# Altium schematic sheet UI_Interface.SchDoc
size A4; SheetNumber: 5; SheetTotal: 6
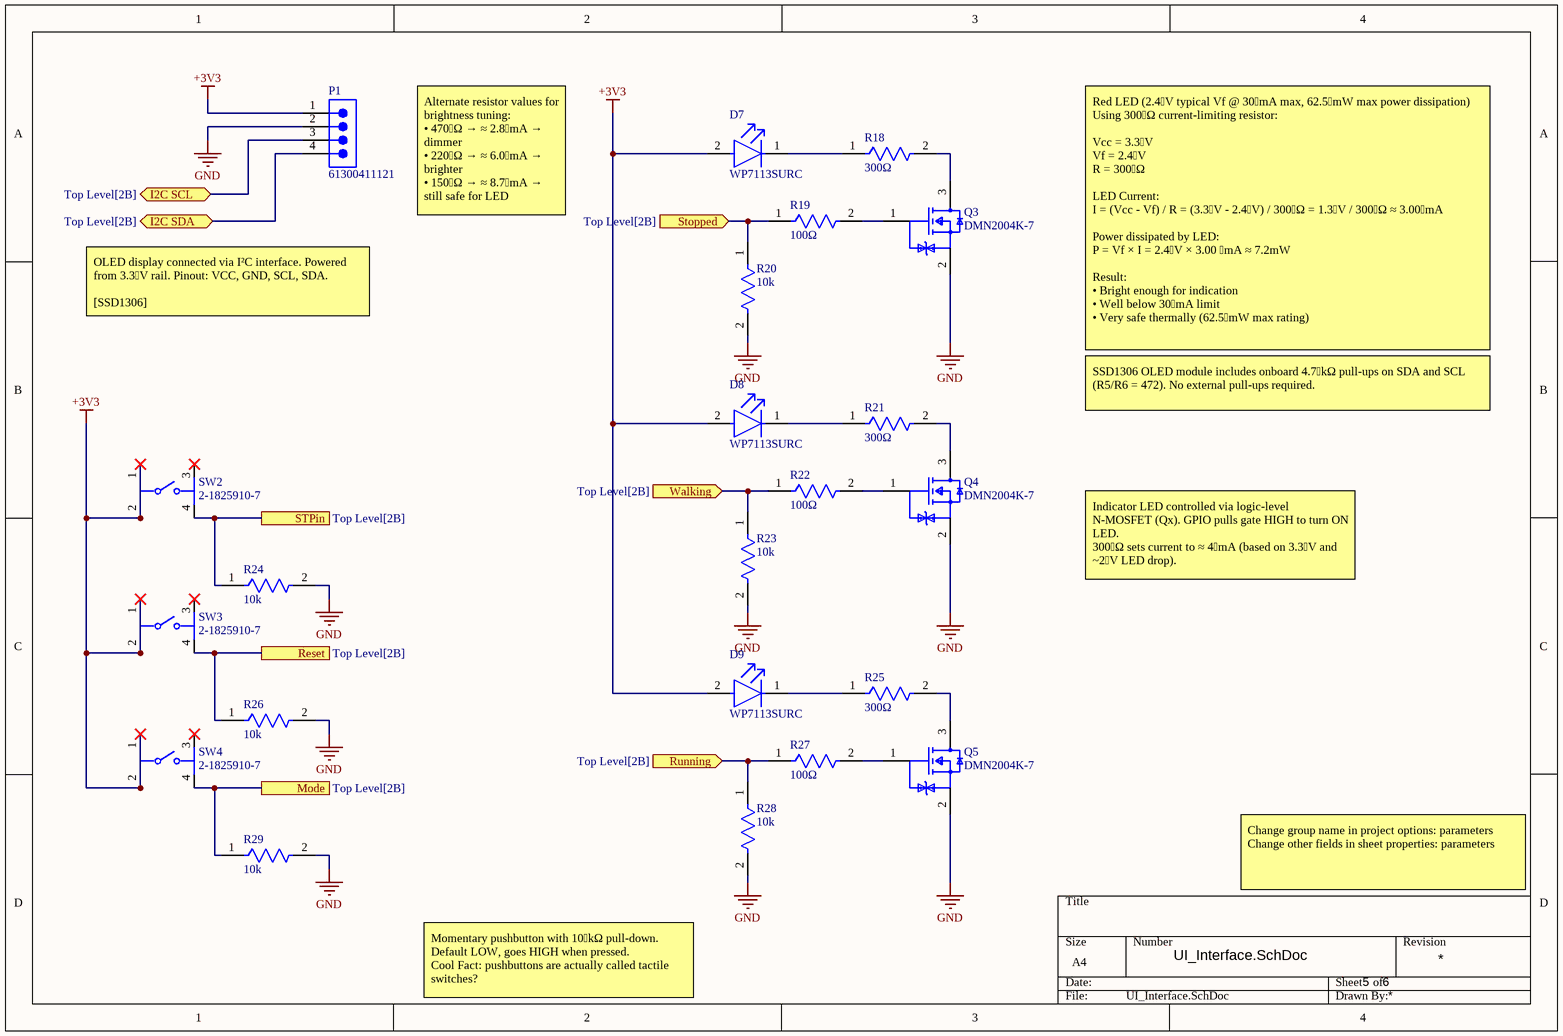
[diagram p0: UI_Interface.SchDoc]

## Parts
D7  WP7113SURC  [FP-WP7113SURC-MFG]
D8  WP7113SURC  [FP-WP7113SURC-MFG]
D9  WP7113SURC  [FP-WP7113SURC-MFG]
P1  61300411121  [61300411121]
Q3  DMN2004K-7  [FP-SOT23-MFG]
Q4  DMN2004K-7  [FP-SOT23-MFG]
Q5  DMN2004K-7  [FP-SOT23-MFG]
R18  300Ω  [FP-RMCF0805-IPC_B]
R19  100Ω  [FP-RMCF0805-IPC_A]
R20  10k  [FP-RMCF0805-MFG]
R21  300Ω  [FP-RMCF0805-IPC_B]
R22  100Ω  [FP-RMCF0805-IPC_A]
R23  10k  [FP-RMCF0805-MFG]
R24  10k  [FP-RMCF0805-MFG]
R25  300Ω  [FP-RMCF0805-IPC_B]
R26  10k  [FP-RMCF0805-MFG]
R27  100Ω  [FP-RMCF0805-IPC_A]
R28  10k  [FP-RMCF0805-MFG]
R29  10k  [FP-RMCF0805-MFG]
SW2  2-1825910-7  [FP-2-1825910-7-MFG]
SW3  2-1825910-7  [FP-2-1825910-7-MFG]
SW4  2-1825910-7  [FP-2-1825910-7-MFG]

## Ports
I2C SCL (bidir, see Top Level[2B]), I2C SDA (bidir, see Top Level[2B]), Mode (see Top Level[2B]), Reset (see Top Level[2B]), Running (in, see Top Level[2B]), Stopped (in, see Top Level[2B]), STPin (see Top Level[2B]), Walking (in, see Top Level[2B])

## Nets
+3V3: D7.2(A) D8.2(A) D9.2(A) P1.1 SW2.1 SW2.2 SW3.1 SW3.2 SW4.1 SW4.2
GND: P1.2 Q3.2(S) Q4.2(S) Q5.2(S) R20.2 R23.2 R24.2 R26.2 R28.2 R29.2
I2C SCL: P1.3 ; port I2C SCL
I2C SDA: P1.4 ; port I2C SDA
Mode: R29.1 SW4.4 ; port Mode
Reset: R26.1 SW3.4 ; port Reset
Running: R27.1 R28.1 ; port Running
Stopped: R19.1 R20.1 ; port Stopped
STPin: R24.1 SW2.4 ; port STPin
Walking: R22.1 R23.1 ; port Walking
NetD7_1: D7.1(C) R18.1
NetD8_1: D8.1(C) R21.1
NetD9_1: D9.1(C) R25.1
NetQ3_1: Q3.1(G) R19.2
NetQ3_3: Q3.3(D) R18.2
NetQ4_1: Q4.1(G) R22.2
NetQ4_3: Q4.3(D) R21.2
NetQ5_1: Q5.1(G) R27.2
NetQ5_3: Q5.3(D) R25.2

Not connected (* = marked no-connect by the designer): SW2 3*; SW3 3*; SW4 3*

## Notes on the sheet
- Alternate resistor values for brightness tuning:
  • 470 Ω → ≈ 2.8 mA → dimmer
  • 220 Ω → ≈ 6.0 mA → brighter
  • 150 Ω → ≈ 8.7 mA → still safe for LED
- OLED display connected via I²C interface. Powered from 3.3 V rail. Pinout: VCC, GND, SCL, SDA.
  [SSD1306]
- Red LED (2.4 V typical Vf @ 30 mA max, 62.5 mW max power dissipation)
  Using 300 Ω current-limiting resistor:
  Vcc = 3.3 V
  Vf = 2.4 V
  R = 300 Ω
  LED Current:
  I = (Vcc - Vf) / R = (3.3 V - 2.4 V) / 300 Ω = 1.3 V / 300 Ω ≈ 3.00 mA
  Power dissipated by LED:
  P = Vf × I = 2.4 V × 3.00  mA ≈ 7.2mW
  Result:
  • Bright enough for indication
  • Well below 30 mA limit
  • Very safe thermally (62.5 mW max rating)
- SSD1306 OLED module includes onboard 4.7 kΩ pull-ups on SDA and SCL (R5/R6 = 472). No external pull-ups required.
- Indicator LED controlled via logic-level N-MOSFET (Qx). GPIO pulls gate HIGH to turn ON LED.
  300 Ω sets current to ≈ 4 mA (based on 3.3 V and ~2 V LED drop).
- Change group name in project options: parameters
  Change other fields in sheet properties: parameters
- Momentary pushbutton with 10 kΩ pull-down. Default LOW, goes HIGH when pressed.
  Cool Fact: pushbuttons are actually called tactile switches?

## Library data of the parts
D7-D9 = CMP-00682-00869413-1: WP7113SURC Red 5 mm 20 º Water Clear 3800 mcd 1.9 V Solid State LED Lamp - T-1 3/4; NexarPartId: 869413; Luminous Intensity: 1.4cd; Viewing Angle: 20°; Reverse Voltage: 5V; Wavelength: 628nm; Lens Style: Clear, Dome; Max Junction Temperature (Tj): 115°C; Power Dissipation: 75mW; Dominant Wavelength: 630nm; Test Current: 20mA; Forward Voltage: 1.9V; Min Operating Temperature: -40°C; Illumination Color: Red; Color: Red; RoHS: Compliant; Packaging: Bulk; Mount: Through Hole; Forward Current: 20mA; Height: 8.6mm; Case/Package: Radial; Lead Free: Lead Free; Max Operating Temperature: 85°C
P1 = CMP-1502-01064-3: NexarPartId: 32855522; Operating Supply Voltage: 250V; Pitch: 2.54mm; Contact Resistance: 20mΩ; Number of Positions: 4; Current Rating: 3A; Connector Type: Male Pin; Gender: Male; Contact Plating: Gold; Height: 8.89mm; Lead Pitch: 2.54mm; Lead Free: Lead Free; Contact Mating Length: 5.9944mm; Number of Rows: 1; Termination: Solder; Packaging: Bulk; REACH SVHC: Unknown; Min Operating Temperature: -40°C; RoHS: Compliant; Number of Contacts: 4; Voltage Rating: 250V; Color: Black; Max Operating Temperature: 105°C; Contact Material: Copper; Mount: Through Hole; Orientation: Vertical; Number of Pins: 4
Q3-Q5 = CMP-12801-000057-1: MOSFET N-CH 20V 0.63A SOT23-3; Manufacturer: Diodes Inc.; Drain To Source Resistance: 0.4Ω; Turn Off Delay Time: 59.4ns; Continuous Drain Current: 630mA; Pulse Drain Current: 1.5A; Gate To Source Voltage: 8V; Reverse Recovery Time: 5.5ns; Number Of N Channels: 1; Depletion Mode: False; Max Forward Diode Voltage: 1V; Threshold Vgs Min: 0.5V; Turn On Delay Time: 5.7ns; Standoff Height: 0.013mm; Input Capacitace At Vds: 150pF @ 16V; Rthja Max: 357°C/W; Reverse Recovery Charge: 0.85nC; Automotive Grade: Grade 0; Max Junction Temp: +150°C; Power Dissipation: 350mW; Gate Charge At Vgs: 0.9nC @ 4.5V; Octopart: https://octopart.com/dmn2004k-7-diodes+inc.-7127688; Mouser Description: MOSFET 20V 540mA; Lead Free: Yes; Footprint Url: https://www.diodes.com/assets/Package-Files/SOT23.pdf; Height: 1.1mm; Temperature: -65°C to +150°C; Device Class L2: Transistors; Device Class L1: Discrete Semiconductors; ComponentLink2Description: Datasheet; RoHS: TRUE; Device Class L3: MOSFETs; Manufacturer Part Number: DMN2004K-7; Threshold Vgs Max: 1V; Number Of Channels: 1; Automotive: Yes; Category: Trans; Temperature Range Low: -65°C; Drain To Source Voltage: 20V; Drain To Source Breakdown Voltage: 20V; ComponentLink2URL: https://www.diodes.com/assets/Datasheets/ds30938.pdf; Temperature Range High: +150°C; Package: SOT23; Digikey Description: MOSFET N-CH 20V 0.63A SOT23-3
R18 R21 R25 = CMP-26527-003681-1: 300Ω ±5% 0.125W 0805 Thick Film Chip Resistor AEC-Q200 compliant, RMCF0805JT300R; Temperature Coefficient: 200ppm/°C; Resistance: 300R; Max Power Dissipation: 125mW; Tolerance: 5%; Features: Automotive AEC-Q200; Radiation Hardening: No; Case/Package: 0805; Mount: Surface Mount; Number of Terminations: 2; RoHS Compliant: Yes; Resistor Type: Thick Film; Length: 0.079inch; Height: 0.026inch; Width: 0.049inch; Package Quantity: 5000; Series: RMCF; Case Code (Metric): 2012; Max Operating Temperature: 155°C; Packaging: Tape and Reel; Contact Plating: Tin; Case Code (Imperial): 0805; Min Operating Temperature: -55°C
R19 R22 R27 = CMP-26527-001731-1: 100Ω ±1% 0.125W 0805 Thick Film Chip Resistor AEC-Q200 compliant, RMCF0805FT100R; Power Rating: 250mW; Temperature Coefficient: 100ppm/°C; Resistance: 100R; Max Power Dissipation: 125mW; Radiation Hardening: No; RoHS Compliant: Yes; Case Code (Imperial): 0805; Depth: 1.25mm; Length: 2mm; Min Operating Temperature: -55°C; Series: RMCF; Packaging: Tape and Reel; Features: Automotive AEC-Q200; Height: 0.026inch; Size Code: 0805; Tolerance: 1%; Number of Terminations: 2; Max Operating Temperature: 155°C; Case/Package: 0805; Width: 0.049inch; Contact Plating: Tin; Resistor Type: Thick Film; Construction: Rectangular; Lead Free: Lead Free; Military Standard: Not; Case Code (Metric): 2012; Mount: Surface Mount
R20 R23 R24 R26 R28 R29 = CMP-26527-000121-1: RES 10K OHM 1% 1/8W 0805, RMCF0805FT10K0; Power Rating: 125mW; Resistance: 10kR; Temperature Coefficient: 100ppm/°C; Depth: 1.25mm; Construction: Rectangular; Packaging: Tape and Reel; Tolerance: 1%; Lead Free: Lead Free; Case/Package: 0805; RoHS Compliant: Yes; Series: RMCF; Width: 0.049inch; Max Power Dissipation: 125mW; Contact Plating: Tin; Height: 0.026inch; Mount: Surface Mount; Resistor Type: Thick Film; Size Code: 0805; Length: 2mm; Max Operating Temperature: 155°C; Features: Automotive AEC-Q200; Radiation Hardening: No; Case Code (Imperial): 0805; Min Operating Temperature: -55°C; Case Code (Metric): 2012; Number of Terminations: 2; Military Standard: Not
SW2-SW4 = CMP-03402-000004-1: SWITCH TACTILE SPST-NO 0.05A 24V; Manufacturer: TE Connectivity; Contact Current Rating: 50mA; Operating Force: 160gf; Electromechanical Life: 100000Cycles; Contact Resistance: 100mΩ; ComponentLink2Description: Datasheet; Height: 13.3mm; Digikey Description: SWITCH TACTILE SPST-NO 0.05A 24V; Device Class L2: Switches; Category: Switch; Device Class L3: Pushbutton Switches; Manufacturer Part Number: 2-1825910-7; Device Class L1: Electromechanical; Mount: Through Hole; Temperature Range High: +85°C; ComponentLink2URL: https://www.te.com/commerce/DocumentDelivery/DDEController?Action=showdoc&DocId=Customer+Drawing%7F1825910%7FC10%7Fpdf%7FEnglish%7FENG_CD_1825910_C10.pdf%7F2-1825910-7; RoHS: TRUE; Temperature: -35°C to +85°C; Mouser Description: Switch Tactile OFF (ON) SPST Extended Round Button PC Pins 0.05A 24VDC 100000Cycles 1.57N Thru-Hole Loose; Automotive: No; Voltage Rating Dc: 24V; Package: 2-1825910-7; Lead Free: Yes; Octopart: https://octopart.com/2-1825910-7-te+connectivity-42270510; Temperature Range Low: -35°C; Throw Configuration: SPST-NO